# Altium project HV_BMS.PrjPcb
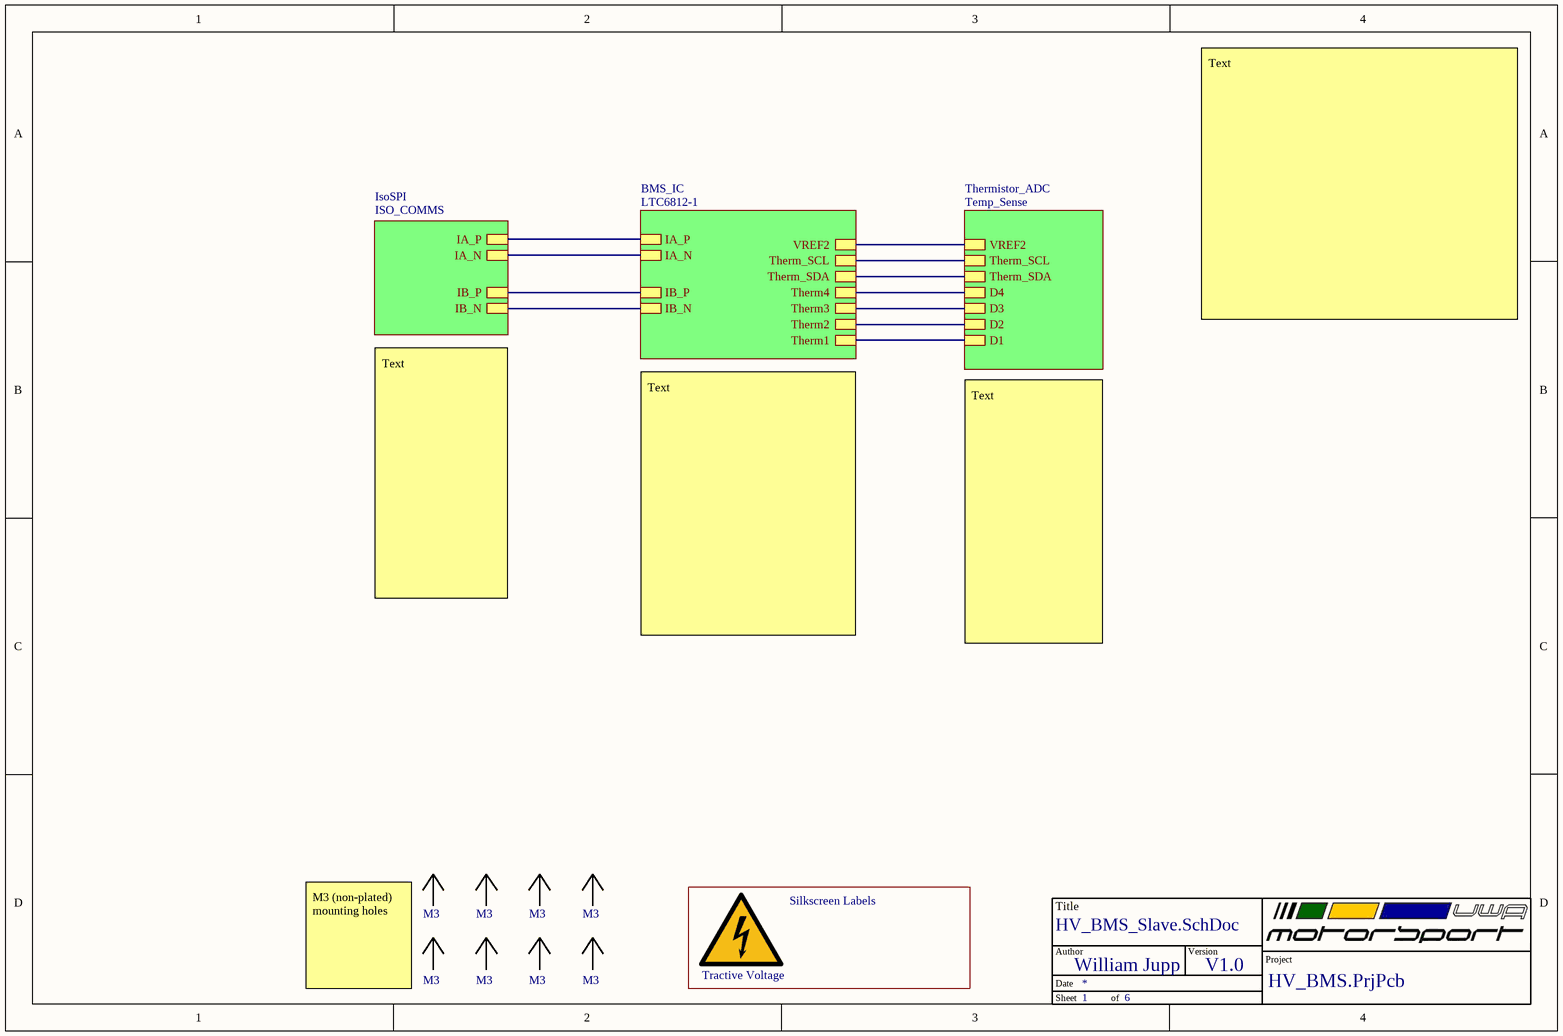
[diagram p0: HV_BMS_Slave.SchDoc]
ProAuthor: William Jupp; Version: V1.0
3 sheets, 54 parts. Net scope: hierarchical (ports join the sheet entries above them; power ports are global).
Board file: Slave_LHS.PcbDoc
Sheets:
  HV_BMS_Slave.SchDoc
    BMS_IC = LTC6812-1.SchDoc
    IsoSPI = ISO_COMMS.SchDoc

## Sheet HV_BMS_Slave.SchDoc: HV_BMS_Slave1
size A4; Revision: V1.0; SheetNumber: 1; SheetTotal: 6

### Parts
(Parts that share a designator on the sheet are numbered #1, #2 ... from top to bottom, then left to right.)
1  UWAM Logo  [UWAM Logo]  (value not drawn)  (no BOM)
*#1  TitleBlock  (value not drawn)  (graphical)
?  Tractive voltage symbol  [Tractive voltage]  (value not drawn)  (no BOM)
M3#1  M3 Mounting Holes  [M3 MH]  (value not drawn)  (no BOM)
M3#2  M3 Mounting Holes  [M3 MH]  (value not drawn)  (no BOM)
M3#3  M3 Mounting Holes  [M3 MH]  (value not drawn)  (no BOM)
M3#4  M3 Mounting Holes  [M3 MH]  (value not drawn)  (no BOM)
M3#5  M3 Mounting Holes  [M3 MH]  (value not drawn)  (no BOM)
M3#6  M3 Mounting Holes  [M3 MH]  (value not drawn)  (no BOM)
M3#7  M3 Mounting Holes  [M3 MH]  (value not drawn)  (no BOM)
M3#8  M3 Mounting Holes  [M3 MH]  (value not drawn)  (no BOM)

### Blocks framed on the sheet
Silkscreen Labels: 1 ?

### Sub-sheets
BMS_IC = LTC6812-1: IA_N, IA_P, IB_N, IB_P, Therm2, Therm3, Therm4, Therm1, Therm_SCL, Therm_SDA, VREF2
IsoSPI = ISO_COMMS: IA_N, IA_P, IB_N, IB_P
Thermistor_ADC = Temp_Sense (file not in this document): Therm_SDA, Therm_SCL, D4, D3, D1, D2, VREF2

### Nets
IA_N: sheet BMS_IC/IA_N, sheet IsoSPI/IA_N
IA_P: sheet BMS_IC/IA_P, sheet IsoSPI/IA_P
IB_N: sheet BMS_IC/IB_N, sheet IsoSPI/IB_N
IB_P: sheet BMS_IC/IB_P, sheet IsoSPI/IB_P
VREF2: sheet BMS_IC/VREF2, sheet Thermistor_ADC/VREF2
NetU6_42: sheet BMS_IC/Therm_SDA, sheet Thermistor_ADC/Therm_SDA
NetU6_43: sheet BMS_IC/Therm_SCL, sheet Thermistor_ADC/Therm_SCL
NetU6_44: sheet BMS_IC/Therm1, sheet Thermistor_ADC/D1
NetU6_45: sheet BMS_IC/Therm2, sheet Thermistor_ADC/D2
NetU6_46: sheet BMS_IC/Therm3, sheet Thermistor_ADC/D3
NetU6_47: sheet BMS_IC/Therm4, sheet Thermistor_ADC/D4

### Notes on the sheet
- Text
- (near M3#1) M3 (non-plated) mounting holes
- (in symbol TitleBlock) Title; Author; Version; Project; Date; Sheet; of
- (in symbol Tractive voltage symbol) Tractive Voltage

## Sheet LTC6812-1.SchDoc
size A4; SheetNumber: 4; SheetTotal: 6
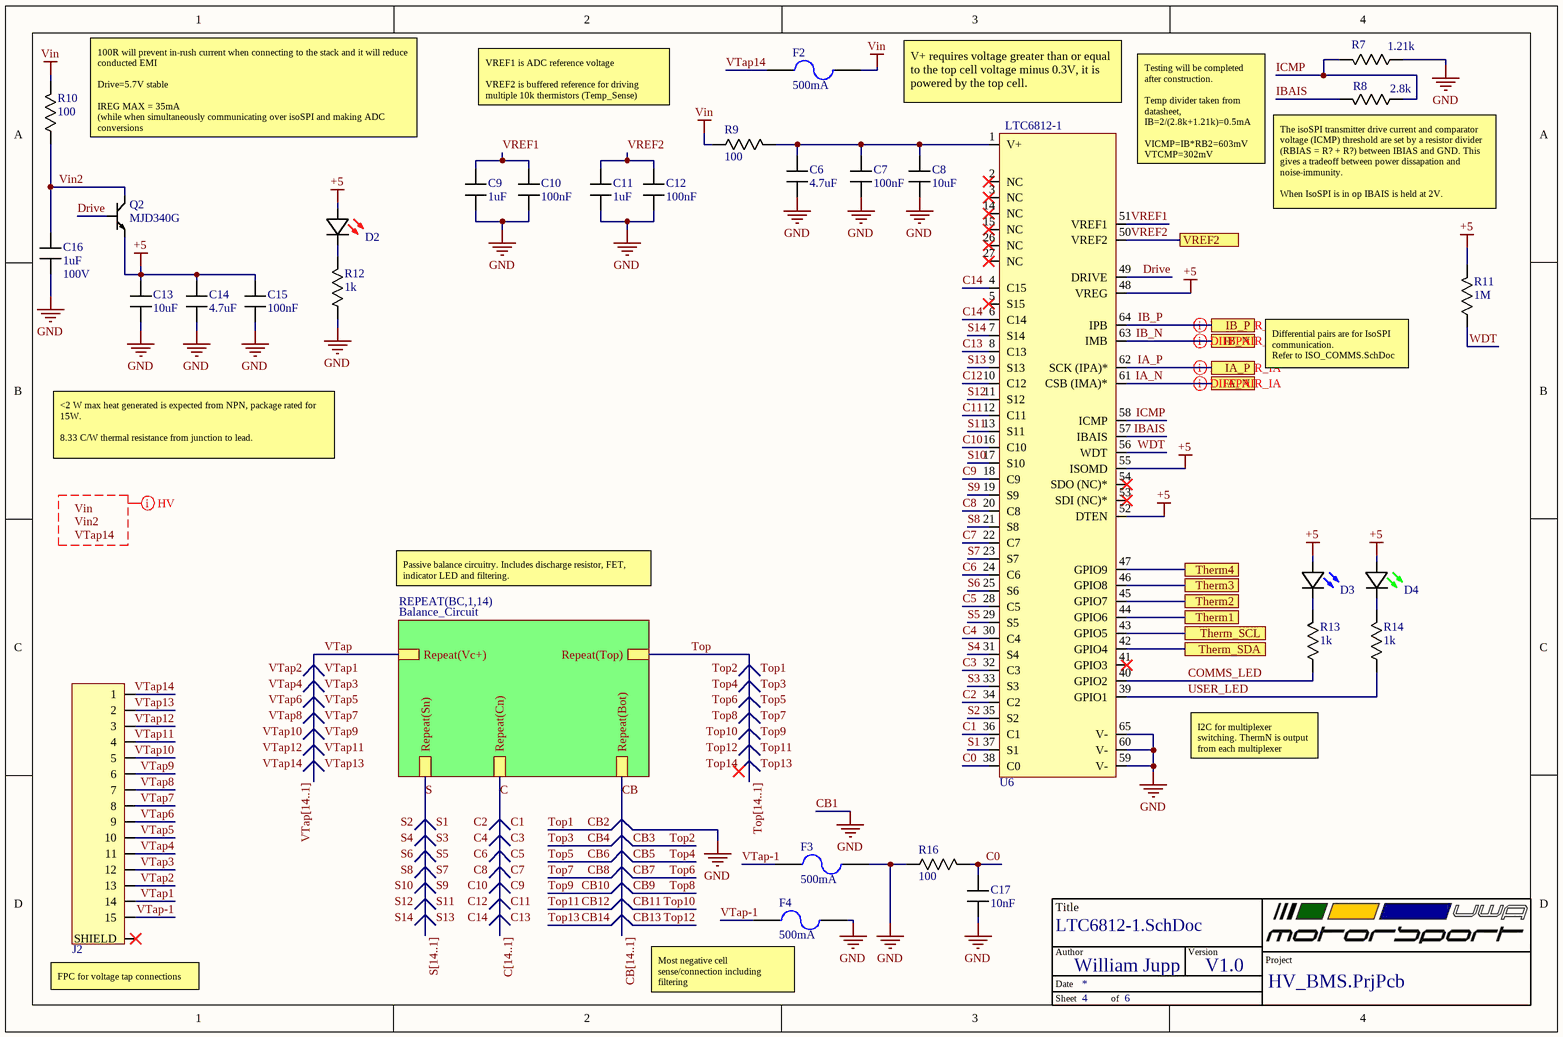
[diagram p1: LTC6812-1.SchDoc]

### Parts
(Parts that share a designator on the sheet are numbered #1, #2 ... from top to bottom, then left to right.)
*#2  TitleBlock  (value not drawn)  (graphical)
C6  value 4.7uF  [C_0603]  (hidden comment: C)
C7  value 100nF  [C_0603]  (hidden comment: C)
C8  value 10uF  [C_0603]  (hidden comment: C)
C9  value 1uF  [C_0603]  (hidden comment: C)
C10  value 100nF  [C_0603]  (hidden comment: C)
C11  value 1uF  [C_0603]  (hidden comment: C)
C12  value 100nF  [C_0603]  (hidden comment: C)
C13  value 10uF  [C_0603]  (hidden comment: C)
C14  value 4.7uF  [C_0603]  (hidden comment: C)
C15  value 100nF  [C_0603]  (hidden comment: C)
C16  value 1uF  Voltage: 100V  [C_0603]  (hidden comment: C)
C17  value 10nF  [C_0603]  (hidden comment: C)
D2  150060SS55040  [LED (0603)]  (value not drawn)
D3  150060BS55040  [LED (0603)]  (value not drawn)
D4  150060GS55040  [LED (0603)]  (value not drawn)
F2  Current Rating: 500mA  [0466.500NR]  (hidden comment: 0466.500NR)
F3  Current Rating: 500mA  [0466.500NR]  (hidden comment: 0466.500NR)
F4  Current Rating: 500mA  [0466.500NR]  (hidden comment: 0466.500NR)
J2  1-84953-5  [1-84953-5]  (value not drawn)
Q2  MJD340G  [TO-252-3]
R7  value 1.21k  [R-0603]  (hidden comment: Resistor)
R8  value 2.8k  [R-0603]  (hidden comment: RB1)
R9  value 100  [R_2010]  (hidden comment: ERJ-12ZYJ101U)
R10  value 100  [R_2010]  (hidden comment: ERJ-12ZYJ101U)
R11  value 1M  [R-0603]  (hidden comment: Resistor)
R12  value 1k  [R-0603]  (hidden comment: Resistor)
R13  value 1k  [R-0603]  (hidden comment: Resistor)
R14  value 1k  [R-0603]  (hidden comment: Resistor)
R16  value 100  [R-0603]  (hidden comment: Resistor)
U6  LTC6812-1  [64-eLQFP]

### Sub-sheets
REPEAT(BC,1,14) = Balance_Circuit (file not in this document): Repeat(Cn), Repeat(Sn), Repeat(Vc+), Repeat(Bot), Repeat(Top)

### Ports
IA_N, IA_P, IB_N, IB_P, Therm1, Therm2, Therm3, Therm4, Therm_SCL, Therm_SDA, VREF2

### Nets
+5: C13.2 C14.2 C15.2 D2.2(A) D3.2(A) D4.2(A) Q2.3(Emitter) R11.1 U6.48(VREG) U6.52(DTEN) U6.55(ISOMD)
CB1: C6.1 C7.1 C8.1 C9.1 C10.1 C11.1 C12.1 C13.1 C14.1 C15.1 C16.1 C17.1 F3.2 F4.2 R7.1 R12.1 R16.1 U6.59(V-) U6.60(V-) U6.65(V-)  [also labelled GND]
Vin: F2.2 R9.1 R10.2
C: sheet REPEAT(BC,1,14)/Repeat(Cn)
C0: C17.2 R16.2 U6.38(C0)
C1: U6.36(C1)
C2: U6.34(C2)
C3: U6.32(C3)
C4: U6.30(C4)
C5: U6.28(C5)
C6: U6.24(C6)
C7: U6.22(C7)
C8: U6.20(C8)
C9: U6.18(C9)
C10: U6.16(C10)
C11: U6.12(C11)
C12: U6.10(C12)
C13: U6.8(C13)
C14: U6.4(C15) U6.6(C14)
CB: sheet REPEAT(BC,1,14)/Repeat(Bot)
COMMS_LED: R13.1 U6.40(GPIO2)
Drive: Q2.1(Base) U6.49(DRIVE)
IA_N: U6.61(CSB_(IMA)*) ; port IA_N
IA_P: U6.62(SCK_(IPA)*) ; port IA_P
IB_N: U6.63(IMB) ; port IB_N
IB_P: U6.64(IPB) ; port IB_P
IBAIS: R8.2 U6.57(IBAIS)
ICMP: R7.2 R8.1 U6.58(ICMP)
S: sheet REPEAT(BC,1,14)/Repeat(Sn)
S1: U6.37(S1)
S2: U6.35(S2)
S3: U6.33(S3)
S4: U6.31(S4)
S5: U6.29(S5)
S6: U6.25(S6)
S7: U6.23(S7)
S8: U6.21(S8)
S9: U6.19(S9)
S10: U6.17(S10)
S11: U6.13(S11)
S12: U6.11(S12)
S13: U6.9(S13)
S14: U6.7(S14)
Top: sheet REPEAT(BC,1,14)/Repeat(Top)
USER_LED: R14.1 U6.39(GPIO1)
Vin2: C16.2 Q2.2(Collector) R10.1
VREF1: C9.2 C10.2 U6.51(VREF1)
VREF2: C11.2 C12.2 U6.50(VREF2) ; port VREF2
VTap: sheet REPEAT(BC,1,14)/Repeat(Vc+)
VTap1: J2.14
VTap2: J2.13
VTap3: J2.12
VTap4: J2.11
VTap5: J2.10
VTap6: J2.9
VTap7: J2.8
VTap8: J2.7
VTap9: J2.6
VTap10: J2.5
VTap11: J2.4
VTap12: J2.3
VTap13: J2.2
VTap14: F2.1 J2.1
VTap-1: F3.1 F4.1 J2.15
WDT: R11.2 U6.56(WDT)
NetC6_2: C6.2 C7.2 C8.2 R9.2 U6.1(V+)
NetD2_1: D2.1(K) R12.2
NetD3_1: D3.1(K) R13.2
NetD4_1: D4.1(K) R14.2
NetU6_42: U6.42(GPIO4) ; port Therm_SDA
NetU6_43: U6.43(GPIO5) ; port Therm_SCL
NetU6_44: U6.44(GPIO6) ; port Therm1
NetU6_45: U6.45(GPIO7) ; port Therm2
NetU6_46: U6.46(GPIO8) ; port Therm3
NetU6_47: U6.47(GPIO9) ; port Therm4

Not connected (* = marked no-connect by the designer): J2 S(SHIELD)*; U6 2(NC)* 3(NC)* 5(S15)* 14(NC)* 15(NC)* 26(NC)* 27(NC)* 41(GPIO3)* 53(SDI_(NC)*)* 54(SDO_(NC)*)*

### Buses and harness runs
bus C[14..1]
bus CB[14..1]
bus S[14..1]
bus Top[14..1]
bus VTap[14..1]

### Layout directives
differential pair; differential pair class IB: IB_N, IB_P
differential pair; differential pair class IA: IA_N, IA_P
net class HVNetClass: Vin, Vin2, VTap14

### Notes on the sheet
- VREF1 is ADC reference voltage
  VREF2 is buffered reference for driving multiple 10k thermistors (Temp_Sense)
- V+ requires voltage greater than or equal to the top cell voltage minus 0.3V, it is powered by the top cell.
- 100R will prevent in-rush current when connecting to the stack and it will reduce conducted EMI
  Drive=5.7V stable
  IREG MAX = 35mA
  (while when simultaneously communicating over isoSPI and making ADC conversions
- (near U6) Testing will be completed after construction.
  Temp divider taken from datasheet,
  IB=2/(2.8k+1.21k)=0.5mA
  VICMP=IB*RB2=603mV
  VTCMP=302mV
- (near R8) The isoSPI transmitter drive current and comparator
  voltage (ICMP) threshold are set by a resistor divider (RBIAS = R? + R?) between IBIAS and GND. This gives a tradeoff between power dissapation and noise-immunity.
  When IsoSPI is in op IBAIS is held at 2V.
  IP and IM current = 20*IB
- Differential pairs are for IsoSPI communication.
  Refer to ISO_COMMS.SchDoc
- <2 W max heat generated is expected from NPN, package rated for 15W.
  8.33 C/W thermal resistance from junction to lead.
- Passive balance circuitry. Includes discharge resistor, FET, indicator LED and filtering.
- I2C for multiplexer switching. ThermN is output from each multiplexer
- (near J2) FPC for voltage tap connections
- (near F4) Most negative cell sense/connection including filtering
- Labels drawn without touching a wire or pin: C1, C2, C3, C4, C5, C6, C7, C8, C9, C10, C11, C12, C13, C14, S1, S2, S3, S4, S5, S6, S7, S8, S9, S10, S11, S12, S13, S14, Top1, Top2, Top3, Top4, Top5, Top6, Top7, Top8, Top9, Top10, Top11, Top12, Top13, Top14, Vin, Vin2, VTap1, VTap2, VTap3, VTap4, VTap5, VTap6, VTap7, VTap8, VTap9, VTap10, VTap11, VTap12, VTap13, VTap14
- (in symbol TitleBlock) Title; Author; Version; Project; Date; Sheet; of

### Library data of the parts
C6-C8 C13-C17 = Capacitor: ComponentLink1Description: New link; ComponentLink1URL: *
C9-C12 = Capacitor: Bypass caps; ComponentLink1Description: New link; ComponentLink1URL: *
D2 = 150060SS55040: LED RED DIFFUSED 0603 SMD; Manufacturer: Wurth Electronics; Lens Style: Flat; Luminous Intensity: 70mcd; Forward Voltage: 2V; Test Current: 20mA; Viewing Angle: 140°; Dominant Wavelength: 630nm; Lens Size: 0.8mm; Supplier 1: Mouser; Manufacturer Part Number: 150060SS55040; RoHS: No; Category: LEDs; Stock 1: 17006; Pricing 1: 1=0.18000, 10=0.16800, 50=0.16800, 100=0.15200, 1000=0.12100, 10000=0.10600 (USD); Mount: Surface Mount; Case/Package: 0603; Color: Red; Case Code (Imperial): 0603; Case Code (Metric): 1608; Packaging: Tape and Reel; Lens Transparency: Diffused; Length: 1.6mm; Width: 0.8mm; Height: 0.5mm; RoHS Compliant: No; Supplier Part Number 1: 710-150060SS55040
D3 = 150060BS55040: LED BLUE DIFFUSED 0603 SMD; Manufacturer: Wurth Electronics; Lens Style: Flat; Luminous Intensity: 80mcd; Forward Voltage: 3.2V; Test Current: 20mA; Viewing Angle: 140°; Dominant Wavelength: 470nm; Lens Size: 0.8mm; Supplier 1: Mouser; Manufacturer Part Number: 150060BS55040; RoHS: No; Pricing 1: 1=0.18000, 10=0.16800, 50=0.16800, 100=0.15200, 1000=0.12100, 10000=0.10600 (USD); Mount: Surface Mount; Case/Package: 0603; Color: Blue; Packaging: Tape and Reel; Lens Transparency: Diffused; Length: 1.6mm; Width: 0.8mm; Height: 0.5mm; RoHS Compliant: No; ComponentLink1URL: http://www.farnell.com/datasheets/2621640.pdf?src-supplier=Farnell; ComponentLink1Description: http://www.farnell.com/datasheets/2621640.pdf?src-supplier=Farnell; ComponentLink2URL: https://www.we-online.de/web/en/index.php/download/media/07_electronic_components/download_center_1/application_notes_berichte/ano002_leds___the_future_of_horticultural_lighting/ANO002b_EN_LEDs_The_Future_of_Horticultural_Lighting.pdf?src-supplier=Digi-Key; ComponentLink2Description: https://www.we-online.de/web/en/index.php/download/media/07_electronic_components/download_center_1/application_notes_berichte/ano002_leds___the_future_of_horticultural_lighting/ANO002b_EN_LEDs_The_Future_of_Horticultural_Lighting.pdf?src-supplier=Digi-Key; ComponentLink3URL: https://katalog.we-online.de/pbs/datasheet/150060BS55040.pdf?src-supplier=Digi-Key; ComponentLink3Description: https://katalog.we-online.de/pbs/datasheet/150060BS55040.pdf?src-supplier=Digi-Key; ComponentLink4URL: http://www.farnell.com/datasheets/2621640.pdf?src-supplier=Newark; ComponentLink4Description: http://www.farnell.com/datasheets/2621640.pdf?src-supplier=Newark; Supplier Part Number 1: 710-150060BS55040
D4 = 150060GS55040: LED GREEN DIFFUSED 0603 SMD; Manufacturer: Wurth Electronics; Lens Style: Flat; Luminous Intensity: 430mcd; Forward Voltage: 3.2V; Test Current: 20mA; Viewing Angle: 140°; Dominant Wavelength: 525nm; Lens Size: 0.8mm; Supplier 1: Mouser; Manufacturer Part Number: 150060GS55040; RoHS: No; Category: LEDs; Stock 1: 3998; Pricing 1: 1=0.23000, 10=0.21000, 50=0.21000, 100=0.19000, 1000=0.15200, 10000=0.13200 (USD); Mount: Surface Mount; Case/Package: 0603; Color: Green; Case Code (Imperial): 0603; Case Code (Metric): 1608; Packaging: Cut Tape; Lens Transparency: Diffused; Length: 1.6mm; Width: 0.8mm; Height: 0.5mm; RoHS Compliant: No; ComponentLink1URL: http://www.farnell.com/datasheets/2621642.pdf?src-supplier=Farnell; ComponentLink1Description: http://www.farnell.com/datasheets/2621642.pdf?src-supplier=Farnell; ComponentLink2URL: http://katalog.we-online.de/pbs/datasheet/150060GS55040.pdf?src-supplier=Digi-Key; ComponentLink2Description: http://katalog.we-online.de/pbs/datasheet/150060GS55040.pdf?src-supplier=Digi-Key; ComponentLink3URL: https://www.we-online.de/web/en/index.php/download/media/07_electronic_components/download_center_1/application_notes_berichte/ano002_leds___the_future_of_horticultural_lighting/ANO002b_EN_LEDs_The_Future_of_Horticultural_Lighting.pdf?src-supplier=Digi-Key; ComponentLink3Description: https://www.we-online.de/web/en/index.php/download/media/07_electronic_components/download_center_1/application_notes_berichte/ano002_leds___the_future_of_horticultural_lighting/ANO002b_EN_LEDs_The_Future_of_Horticultural_Lighting.pdf?src-supplier=Digi-Key; ComponentLink4URL: https://katalog.we-online.de/pbs/datasheet/150060GS55040.pdf?src-supplier=Digi-Key; ComponentLink4Description: https://katalog.we-online.de/pbs/datasheet/150060GS55040.pdf?src-supplier=Digi-Key; ComponentLink5URL: http://www.farnell.com/datasheets/2621642.pdf?src-supplier=Newark; ComponentLink5Description: http://www.farnell.com/datasheets/2621642.pdf?src-supplier=Newark; Supplier Part Number 1: 710-150060GS55040
F2-F4 = Fuse 2: LITTELFUSE - 0466.500NR - Fuse, Surface Mount, 500 mA, 466 Series, 63 VAC, 63 VDC, Very Fast Acting, 1206; Body Material: Thermoplastic; Voltage Rating (AC): 63V; Resistance: 350mR; DC Cold Resistance: 248mR; Fuse Type: Board Mount (Cartridge Style Excluded); Approvals: UL,CSA; Published: 8-Jun-2000; LatestRevisionDate: 17-Jul-2002; LatestRevisionNote: Re-released for DXP Platform.; PackageReference: PIN-W2/E2.8; Publisher: Altium Limited; PackageDescription: Thru-Hole; 2 Leads; Supplier 1: Mouser; Supplier Part Number 1: 576-0466.500NR; Manufacturer: Littelfuse; Manufacturer Part Number: 0466.500NR; RoHS: Yes; Category: Fuses; Stock 1: 36497; Pricing 1: 1=0.77000, 10=0.59200, 50=0.59200, 100=0.48900, 1000=0.41600, 10000=0.39000 (USD); Mount: Surface Mount; Case/Package: 1206; Number of Pins: 2; Case Code (Metric): 3216; Case Code (Imperial): 1206; Housing Material: Ceramic; Terminal Material: Copper; Min Operating Temperature: -55°C; Max Operating Temperature: 90°C; Packaging: Tape and Reel; Package Quantity: 5000; Voltage Rating (DC): 63V; Series: 466; Voltage Rating: 63V; Termination: SMD/SMT; Fuse Current: 500mA; Working Voltage: 63V; Length: 3.18mm; Width: 0.06inch; Height: 0.023inch; Depth: 1.52mm; Radiation Hardening: No; RoHS Compliant: Yes; REACH SVHC: Unknown; Lead Free: Lead Free; ComponentLink1URL: https://datasheet.ciiva.com/17081/0466-500nr-17081083.pdf?src-supplier=Allied+Electronics; ComponentLink1Description: https://datasheet.ciiva.com/17081/0466-500nr-17081083.pdf?src-supplier=Allied+Electronics; ComponentLink2URL: https://datasheet.ciiva.com/16327/littelfuse-fuse-466-16327478.pdf?src-supplier=Future+Electronics; ComponentLink2Description: https://datasheet.ciiva.com/16327/littelfuse-fuse-466-16327478.pdf?src-supplier=Future+Electronics; ComponentLink3URL: https://datasheet.ciiva.com/299/466seriesdrawing-299207.pdf?src-supplier=Digi-Key; ComponentLink3Description: https://datasheet.ciiva.com/299/466seriesdrawing-299207.pdf?src-supplier=Digi-Key; ComponentLink4URL: https://datasheet.ciiva.com/299/466seriesdrawing-299208.pdf?src-supplier=Digi-Key; ComponentLink4Description: https://datasheet.ciiva.com/299/466seriesdrawing-299208.pdf?src-supplier=Digi-Key; ComponentLink5URL: https://datasheet.ciiva.com/299/466seriesdrawing-299209.pdf?src-supplier=Digi-Key; ComponentLink5Description: https://datasheet.ciiva.com/299/466seriesdrawing-299209.pdf?src-supplier=Digi-Key; ComponentLink6URL: https://datasheet.ciiva.com/14102/ei466-dat-e-14102891.pdf?src-supplier=Distrelec; ComponentLink6Description: https://datasheet.ciiva.com/14102/ei466-dat-e-14102891.pdf?src-supplier=Distrelec; ComponentLink7URL: https://datasheet.ciiva.com/15186/getdatasheetpartid-57351-15186924.pdf?src-supplier=Verical; ComponentLink7Description: https://datasheet.ciiva.com/15186/getdatasheetpartid-57351-15186924.pdf?src-supplier=Verical
J2 = 1-84953-5: Conn FPC Connector SKT 15 POS 1mm Solder RA SMD T/R; Manufacturer: TE Connectivity; Number of Contacts: 15; Wire/Cable Type: Flat Flex; Gender: Receptacle; Current Rating: 1A; Voltage Rating: 200V; Shielding: Unshielded; Connector Type: Receptacle,Connector,Socket; Connector System: Flex-to-Board; Mating Alignment: Yes (With); PCB Mount Alignment: No (Without); PCB Mount Retention: With; Contact Location: Top; PCB Mounting Orientation: Right Angle; Pitch: 0.039inch; Plating Thickness: 2um; Supplier 1: Mouser; Manufacturer Part Number: 1-84953-5; RoHS: Yes; Category: FFC / FPC; Stock 1: 7302; Pricing 1: 1=1.07000, 10=0.87800, 50=0.87800, 100=0.76700, 500=0.65900, 1000=0.65900, 1200=0.58600, 2400=0.53000, 4800=0.51200, 9600=0.48600, 10000=0.48600, 24000=0.47500 (USD); Mount: Surface Mount; Housing Material: Polymer; Housing Color: Natural; Contact Plating: Tin,Bright; Contact Material: Bronze; Min Operating Temperature: -40°C; Max Operating Temperature: 85°C; Termination: SMD/SMT; Orientation: Right Angle; Number of Rows: 1; Number of Positions: 15; Packaging: Tape and Reel; Package Quantity: 1200; Sealable: No (Without); Shrouded: Yes (With); Contact Current Rating: 1A; Max Voltage Rating (AC): 200V; Length: 22.92mm; Width: 0.2575inch; Height: 2.56mm; Depth: 7.3mm; Radiation Hardening: No; ELV: Compliant; ComponentLink1URL: https://datasheet.ciiva.com/669/eng-cd-84953-a3-669110.pdf?src-supplier=Digi-Key; ComponentLink1Description: https://datasheet.ciiva.com/669/eng-cd-84953-a3-669110.pdf?src-supplier=Digi-Key; ComponentLink2URL: https://datasheet.ciiva.com/669/eng-cd-84953-a3-669111.pdf?src-supplier=Digi-Key; ComponentLink2Description: https://datasheet.ciiva.com/669/eng-cd-84953-a3-669111.pdf?src-supplier=Digi-Key; ComponentLink3URL: https://datasheet.ciiva.com/16660/eng-ds-1-1773440-6-0506-16660135.pdf?src-supplier=Avnet+Europe; ComponentLink3Description: https://datasheet.ciiva.com/16660/eng-ds-1-1773440-6-0506-16660135.pdf?src-supplier=Avnet+Europe; ComponentLink4URL: https://datasheet.ciiva.com/669/eng-cd-84953-a3-669112.pdf?src-supplier=Digi-Key; ComponentLink4Description: https://datasheet.ciiva.com/669/eng-cd-84953-a3-669112.pdf?src-supplier=Digi-Key; Supplier Part Number 1: 571-1-84953-5
Q2 = MJD340G: ON SEMICONDUCTOR   MJD340G   Bipolar (BJT) Single Transistor, General Purpose, NPN, 300 V, 15 W, 500 mA, 240; hFE Min: 30; Max Power Dissipation: 15W; Number of Elements: 1; Collector Base Voltage (VCBO): 300V; Emitter Base Voltage (VEBO): 3V; Collector Emitter Saturation Voltage: 1V; Max Collector Current: 500mA; Transition Frequency: 10MHz; Power Dissipation: 1.56W; Supplier 1: RSComponents; Manufacturer: ON Semiconductor; Manufacturer Part Number: MJD340G; RoHS: Yes; Category: BJTs; Stock 1: 1; Pricing 1: 15=0.60500 (USD); Case/Package: DPAK; Number of Pins: 3; Contact Plating: Tin,Matte; Min Operating Temperature: -65°C; Max Operating Temperature: 150°C; Package Quantity: 75; Packaging: Rail/Tube; Polarity: NPN; Collector Emitter Voltage (VCEO): 300V; Collector Emitter Breakdown Voltage: 300V; Element Configuration: Single; Max Frequency: 10MHz; Voltage Rating (DC): 300V; Current Rating: 500mA; Collector-emitter Voltage-Max: 300V; Series: -; Length: 0.264inch; Width: 0.245inch; Height: 0.094inch; Radiation Hardening: No; REACH SVHC: No SVHC; Lead Free: Lead Free; RoHS Compliant: Yes; ComponentLink1URL: https://datasheet.ciiva.com/4721/mjd340-d-112116-4721347.pdf?src-supplier=Mouser; ComponentLink1Description: https://datasheet.ciiva.com/4721/mjd340-d-112116-4721347.pdf?src-supplier=Mouser; ComponentLink2URL: https://datasheet.ciiva.com/15138/getdatasheetpartid-41077-15138708.pdf?src-supplier=Verical; ComponentLink2Description: https://datasheet.ciiva.com/15138/getdatasheetpartid-41077-15138708.pdf?src-supplier=Verical; ComponentLink3URL: https://datasheet.ciiva.com/18429/70100598-18429461.pdf?src-supplier=Allied+Electronics; ComponentLink3Description: https://datasheet.ciiva.com/18429/70100598-18429461.pdf?src-supplier=Allied+Electronics; ComponentLink4URL: https://datasheet.ciiva.com/977/mjd340-d-977159.pdf?src-supplier=Digi-Key; ComponentLink4Description: https://datasheet.ciiva.com/977/mjd340-d-977159.pdf?src-supplier=Digi-Key; ComponentLink5URL: https://datasheet.ciiva.com/11201/mjd340-d-11201899.pdf?src-supplier=Avnet; ComponentLink5Description: https://datasheet.ciiva.com/11201/mjd340-d-11201899.pdf?src-supplier=Avnet; ComponentLink6URL: https://datasheet.ciiva.com/7972/mjd340-d-7972285.pdf?src-supplier=Element14; ComponentLink6Description: https://datasheet.ciiva.com/7972/mjd340-d-7972285.pdf?src-supplier=Element14; ComponentLink7URL: https://datasheet.ciiva.com/16462/mjd340-d-16462206.pdf?src-supplier=Future+Electronics; ComponentLink7Description: https://datasheet.ciiva.com/16462/mjd340-d-16462206.pdf?src-supplier=Future+Electronics; Supplier Part Number 1: 7905343
R7 = Resistor: RB2
R8-R10 = Resistor
U6 = LTC6812-1: Multicell battery stack monitor that measures up to 15 series connected battery cells

## Sheet ISO_COMMS.SchDoc
size A4; SheetNumber: 6; SheetTotal: 6
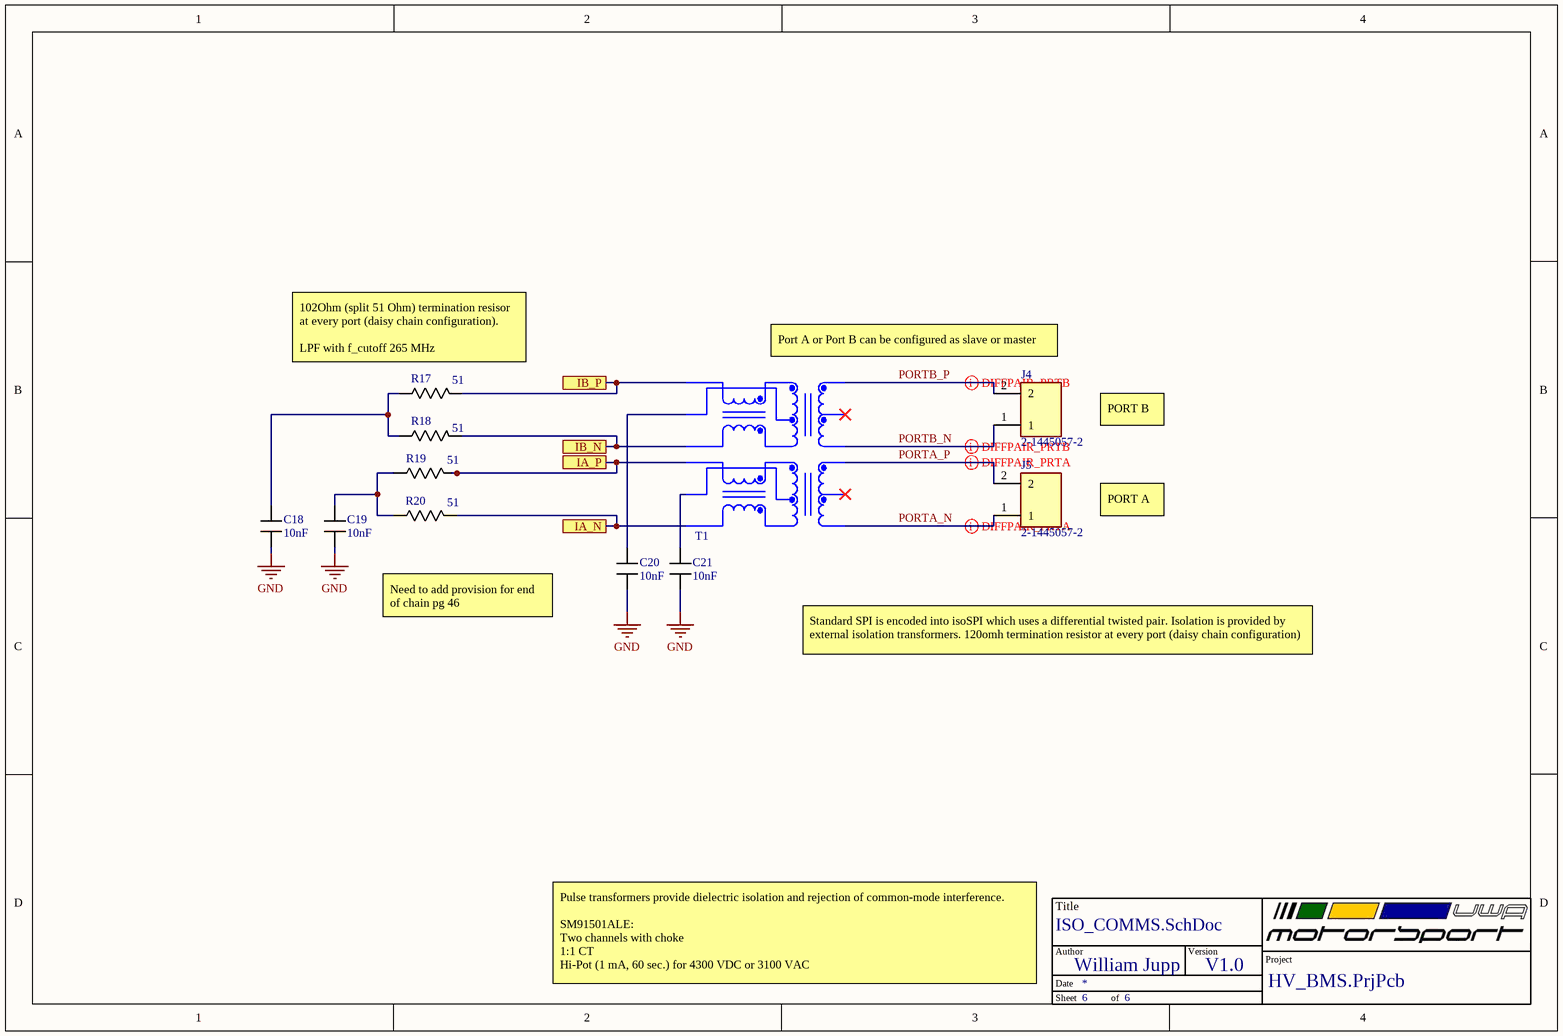
[diagram p2: ISO_COMMS.SchDoc]

### Parts
(Parts that share a designator on the sheet are numbered #1, #2 ... from top to bottom, then left to right.)
*#3  TitleBlock  (value not drawn)  (graphical)
C18  value 10nF  [C_0603]  (hidden comment: C)
C19  value 10nF  [C_0603]  (hidden comment: C)
C20  value 10nF  [C_0603]  (hidden comment: C)
C21  value 10nF  [C_0603]  (hidden comment: C)
J4  2-1445057-2  [TE_2-1445057-2]
J5  2-1445057-2  [TE_2-1445057-2]
R17  value 51  [R-0603]  (hidden comment: Resistor)
R18  value 51  [R-0603]  (hidden comment: Resistor)
R19  value 51  [R-0603]  (hidden comment: Resistor)
R20  value 51  [R-0603]  (hidden comment: Resistor)
T1  SM91501ALE  [SM91501ALE]  (value not drawn)

### Ports
IA_N, IA_P, IB_N, IB_P

### Nets
GND: C18.1 C19.1 C20.2 C21.1  [project net CB1]
IA_N: R20.1 T1.7 ; port IA_N
IA_P: R19.2 T1.9 ; port IA_P
IB_N: R18.1 T1.10 ; port IB_N
IB_P: R17.2 T1.12 ; port IB_P
PORTA_N: J5.1 T1.6
PORTA_P: J5.2 T1.4
PORTB_N: J4.1 T1.3
PORTB_P: J4.2 T1.1
NetC18_2: C18.2 R17.1 R18.2
NetC19_2: C19.2 R19.1 R20.2
NetC20_1: C20.1 T1.11
NetC21_2: C21.2 T1.8

Not connected (* = marked no-connect by the designer): T1 2* 5*

### Layout directives
differential pair; differential pair class PRTB: PORTB_N, PORTB_P
differential pair; differential pair class PRTA: PORTA_N, PORTA_P

### Notes on the sheet
- (near R17) 102Ohm (split 51 Ohm) termination resisor at every port (daisy chain configuration).
  LPF with f_cutoff 265 MHz
- Port A or Port B can be configured as slave or master
- PORT B
- PORT A
- Need to add provision for end of chain pg 46
- Standard SPI is encoded into isoSPI which uses a differential twisted pair. Isolation is provided by external isolation transformers. 120omh termination resistor at every port (daisy chain configuration)
- (near *#3) Pulse transformers provide dielectric isolation and rejection of common-mode interference.
  SM91501ALE:
  Two channels with choke
  1:1 CT
  Hi-Pot (1 mA, 60 sec.) for 4300 VDC or 3100 VAC
- (in symbol TitleBlock) Title; Author; Version; Project; Date; Sheet; of

### Library data of the parts
C18-C21 = Capacitor: ComponentLink1Description: New link; ComponentLink1URL: *
J4 = 2-1445057-2: CONN HEADER 3MM 2POS R/A TIN SMD--; MF: {'manufacturer': u'TE Connectivity'}; Package: None; MP: 2-1445057-2; Availability: Unavailable; Price: None; Value: *
J5 = 2-1445057-2: CONN HEADER 3MM 2POS R/A TIN SMD; MF: {'manufacturer': u'TE Connectivity'}; Package: None; MP: 2-1445057-2; Availability: Unavailable; Price: None; Value: *
T1 = SM91501ALE: BMS XFORMER 2-CH 1600V AECQ +125; Manufacturer: Bourns; Inductance: 150uH; Turns Ratio: 1:1; Supplier 1: Mouser; Manufacturer Part Number: SM91501ALE; RoHS: No; Stock 1: 566; Pricing 1: 1=5.20000, 10=4.21000, 50=3.14000, 100=3.05000, 1000=2.78000, 10000=2.78000 (USD); Mount: Surface Mount; Min Operating Temperature: -40°C; Max Operating Temperature: 125°C; Packaging: Cut Tape; ComponentLink1URL: https://www.bourns.com/docs/product-datasheets/sm91501al.pdf?src-supplier=Digi-Key; ComponentLink1Description: https://www.bourns.com/docs/product-datasheets/sm91501al.pdf?src-supplier=Digi-Key; Supplier Part Number 1: 652-SM91501ALE

## Nets that join several sheets
CB1: LTC6812-1 (20 pins), ISO_COMMS (C18.1 C19.1 C20.2 C21.1)
IA_N: LTC6812-1 (U6.61), ISO_COMMS (R20.1 T1.7)
IA_P: LTC6812-1 (U6.62), ISO_COMMS (R19.2 T1.9)
IB_N: LTC6812-1 (U6.63), ISO_COMMS (R18.1 T1.10)
IB_P: LTC6812-1 (U6.64), ISO_COMMS (R17.2 T1.12)